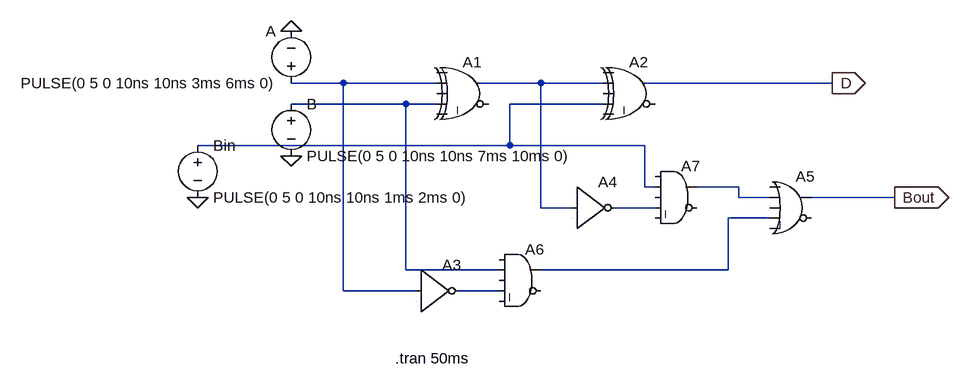
[diagram p0: schematic FullSubstractor.asc]
FullSubstractor.asc, the LTspice schematic file:
Version 4
SHEET 1 880 680
WIRE -256 0 -336 0
WIRE -112 0 -256 0
WIRE 48 0 -48 0
WIRE 144 0 48 0
WIRE 496 0 208 0
WIRE -160 32 -336 32
WIRE -112 32 -160 32
WIRE 144 32 0 32
WIRE 0 96 0 32
WIRE 0 96 -480 96
WIRE 208 96 0 96
WIRE 208 160 208 96
WIRE 224 160 208 160
WIRE 352 160 288 160
WIRE 352 176 352 160
WIRE 400 176 352 176
WIRE 592 176 464 176
WIRE 48 192 48 0
WIRE 96 192 48 192
WIRE 224 192 160 192
WIRE 400 208 336 208
WIRE -160 288 -160 32
WIRE -16 288 -160 288
WIRE 336 288 336 208
WIRE 336 288 48 288
WIRE -256 320 -256 0
WIRE -144 320 -256 320
WIRE -16 320 -80 320
FLAG -336 -80 0
FLAG -336 112 0
FLAG -480 176 0
FLAG 496 0 D
IOPIN 496 0 Out
FLAG 592 176 Bout
IOPIN 592 176 Out
SYMBOL Digital\\xor -64 -48 R0
SYMATTR InstName A1
SYMBOL Digital\\xor 192 -48 R0
SYMATTR InstName A2
SYMBOL Digital\\or 432 128 R0
SYMATTR InstName A5
SYMBOL Digital\\and 16 240 R0
SYMATTR InstName A6
SYMBOL Digital\\and 256 112 R0
SYMATTR InstName A7
SYMBOL Digital\\inv 96 128 R0
SYMATTR InstName A4
SYMBOL Digital\\inv -144 256 R0
SYMATTR InstName A3
SYMBOL voltage -480 80 R0
WINDOW 123 0 0 Left 0
WINDOW 39 0 0 Left 0
SYMATTR InstName Bin
SYMATTR Value PULSE(0 5 0 10ns 10ns 1ms 2ms 0)
SYMBOL voltage -336 16 R0
WINDOW 123 0 0 Left 0
WINDOW 39 0 0 Left 0
SYMATTR InstName B
SYMATTR Value PULSE(0 5 0 10ns 10ns 7ms 10ms 0)
SYMBOL voltage -336 16 R180
WINDOW 0 24 96 Left 2
WINDOW 3 24 16 Left 2
WINDOW 123 0 0 Left 0
WINDOW 39 0 0 Left 0
SYMATTR InstName A
SYMATTR Value PULSE(0 5 0 10ns 10ns 3ms 6ms 0)
TEXT -176 424 Left 2 !.tran 50ms

The netlist it stands for:
* FullSubstractor.asc
A1 0 N001 0 N003 0 0 N002 0 XOR
A2 0 N002 0 N004 0 0 D 0 XOR
A5 0 N005 0 N007 0 0 Bout 0 OR
A6 0 N003 0 N008 0 0 N007 0 AND
A7 0 N004 0 N006 0 0 N005 0 AND
A4 N002 0 0 0 0 N006 0 0 BUF
A3 N001 0 0 0 0 N008 0 0 BUF
V§Bin N004 0 PULSE(0 5 0 10ns 10ns 1ms 2ms 0)
V§B N003 0 PULSE(0 5 0 10ns 10ns 7ms 10ms 0)
V§A N001 0 PULSE(0 5 0 10ns 10ns 3ms 6ms 0)
.tran 50ms
.backanno
.end

* Results of the author's LTspice run, read from the files saved beside the schematic
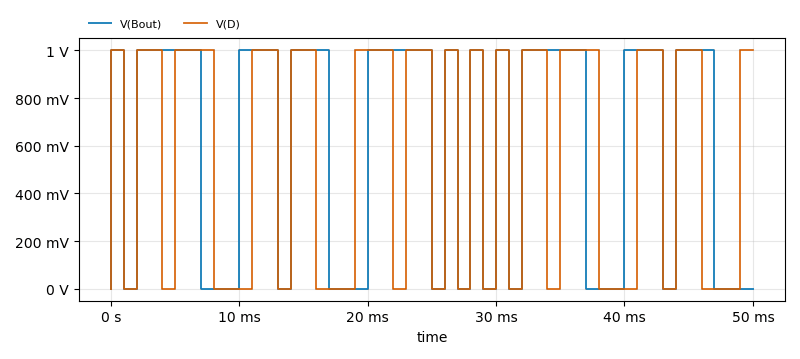
[diagram p1: Transient Analysis of FullSubstractor.asc, plotted from the saved traces]
* Transient Analysis, 1 run:
*   V(Bout): min 0 V, max 1 V, average 620 mV, rms 787.4 mV, last 0 V
*   V(D): min 0 V, max 1 V, average 560 mV, rms 748.3 mV, last 1 V